# EasyEDA Pro project ProDoc_XC7K35T_GTP_USB_Core_LiteRevB.1.brd_2025-10-08.epro, schematic _CBB_INTERFACE_Type-C_24P_USB3.0_HD3SS3220
Board Name: _CBB_INTERFACE_Type-C_24P_USB3.0_HD3SS3220; Create Date: 2025-08-26; Page Name: P1; Project Name: XC7A35TCSG325_USB3_Demo; Schematic Name: _CBB_INTERFACE_Type-C_24P_USB3.0_HD3SS3220; Update Date: 2025-09-28; Company: Xxx Studio; Drawed: A.W.2666; Page Size: A3; Reviewed: A.W.2666; Version: Rev.A.0
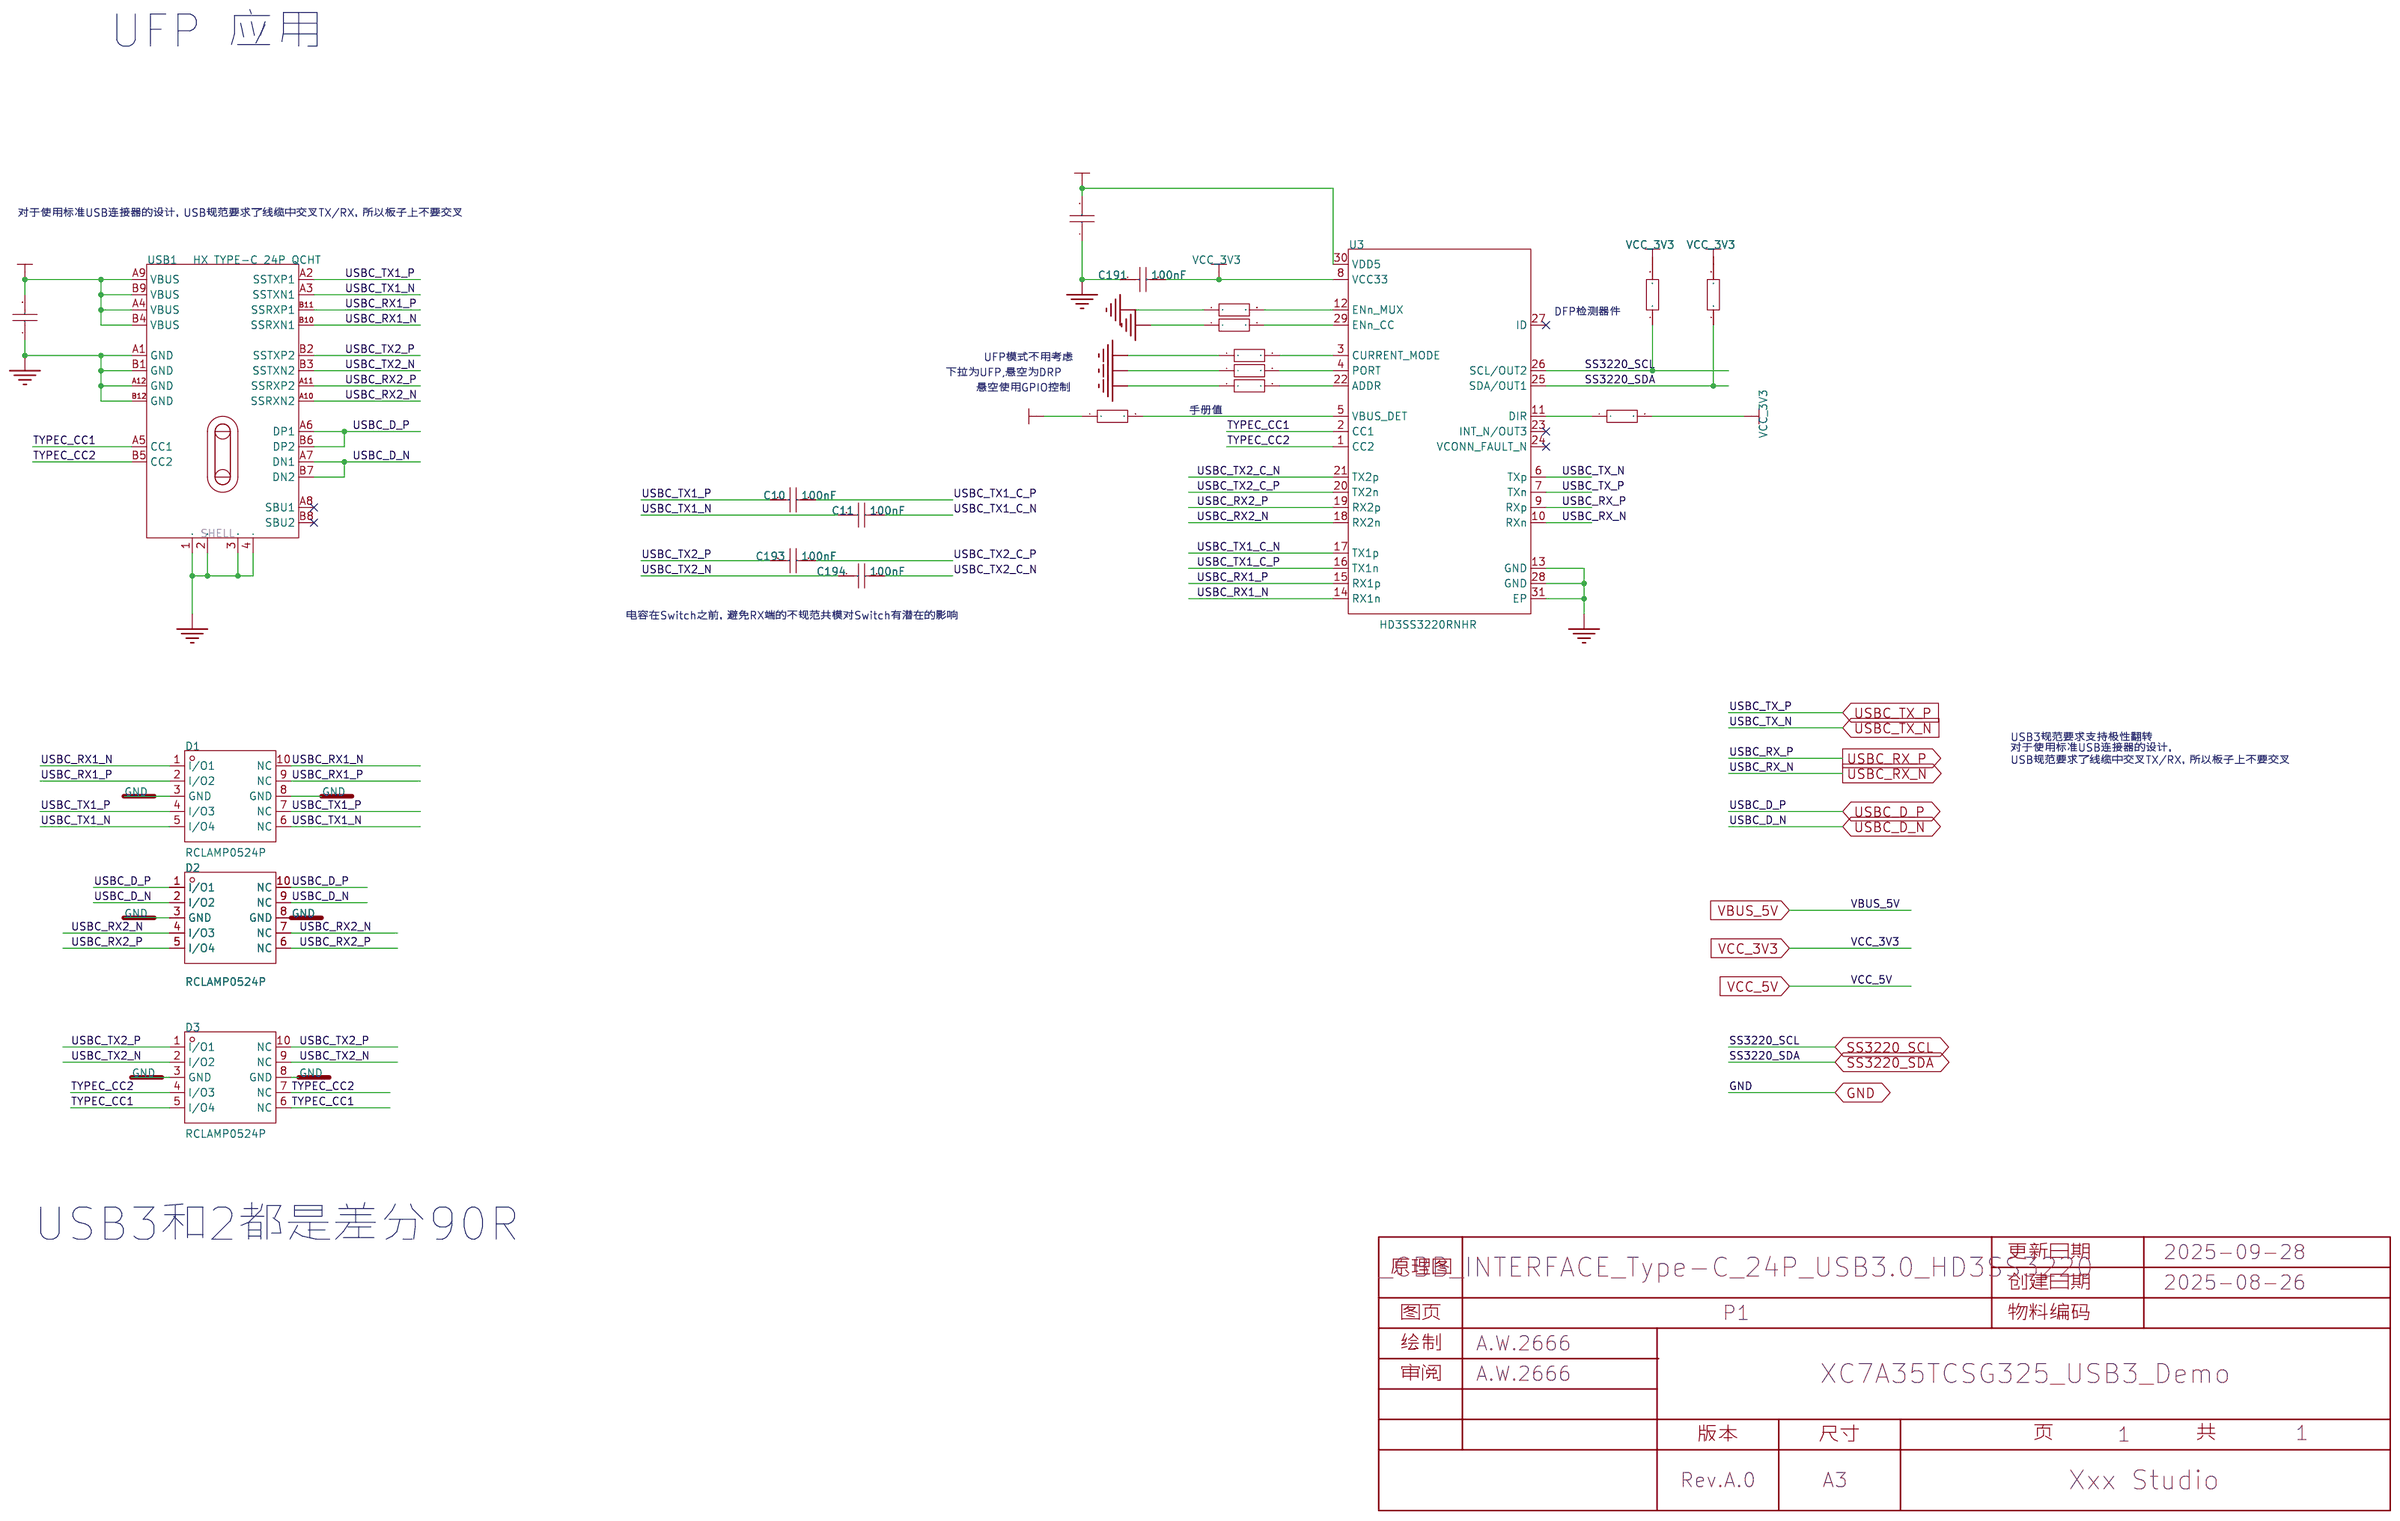
[diagram p12: schematic sheet]

## Parts
C1  4.7uF  [C0603_1608M]
C10  100nF  [C0402_1005M_S]
C11  100nF  [C0402_1005M_S]
C191  100nF  [C0402_1005M_S]
C192  4.7uF  [C0603_1608M_S]
C193  100nF  [C0402_1005M_S]
C194  100nF  [C0402_1005M_S]
D1  RCLAMP0524P  [DFN2510-10_L2.5-W1.0-P0.50-BL]
D2  RCLAMP0524P  [DFN2510-10_L2.5-W1.0-P0.50-BL]
D3  RCLAMP0524P  [DFN2510-10_L2.5-W1.0-P0.50-BL]
R2  910kΩ  [R0402_1005M_S]
R123  10kΩ  [R0402_1005M_S]  (no BOM)
R124  4.7kΩ  [R0402_1005M_S]
R125  200kΩ  [R0402_1005M_S]
R126  10kΩ  [R0402_1005M_S]
R127  10kΩ  [R0402_1005M_S]  (no BOM)
R128  10kΩ  [R0402_1005M_S]
R129  200kΩ  [R0402_1005M_S]
R130  200kΩ  [R0402_1005M_S]
U3  HD3SS3220RNHR  [WQFN-30_L4.5-W2.5-P0.4-BL-EP]
USB1  HX TYPE-C 24P QCHT  [TYPE-C-SMD_TYPE-C-24P_QCHT]

## Library data of the parts
C1 C192 = GRM188Z71A475KE15D: 容值:4.7uF;精度:±10%;额定电压:10V;材质(温度系数):X7R;; LCSC Part Name: 4.7uF ±10% 10V; Supplier Part: C913474; Manufacturer: muRata(村田); Supplier Footprint: 0603; JLCPCB Part Class: Extended Part; Datasheet: https://atta.szlcsc.com/upload/public/pdf/source/20201110/C913474_4DF5AD40636EBA2467CAA7A6A4C37EEF.pdf; Supplier: LCSC; Tolerance: ±10%; Voltage Rated: 10V; Temperature Coefficient: X7R
C10 C11 C191 C193 C194 = C0402: 容值:100nF;精度:±10%;额定电压:16V;材质(温度系数):X7R;; LCSC Part Name: 100nF ±10% 16V; Supplier Part: C60474; Manufacturer: YAGEO(国巨); Manufacturer Part: CC0402KRX7R7BB104; Supplier Footprint: 0402; Datasheet: https://atta.szlcsc.com/upload/public/pdf/source/20211223/9278FD768280B81DDBEF48FA36411A03.pdf; Supplier: LCSC; Tolerance: ±10%; Voltage Rated: 16V; Temperature Coefficient: X7R
D1-D3 = RCLAMP0524P_C907837: 极性:单向;反向截止电压(Vrwm):5V;最大钳位电压:17V;峰值脉冲电流(Ipp):4.5A;击穿电压:6.8V;; Supplier Part: C907837; Manufacturer: TECH PUBLIC(台舟); Supplier Footprint: DFN2510-10; JLCPCB Part Class: 扩展库; Datasheet: https://atta.szlcsc.com/upload/public/pdf/source/20210810/AE3DE9AC94AD2A317FD9BEA10653400F.pdf; Supplier: LCSC; polarity: 单向; Reverse Stand-Off Voltage (Vrwm): 5V; Maximum Clamping Voltage: 17V; Peak Pulse Current (Ipp): 4.5A; Breakdown Voltage: 6.8V; Reverse Leakage Current (Ir): 80nA; Number of Lines: 四路; Operating Temperature: -55℃~+125℃; level of protection: IEC 61000-4-2; Type: ESD
R2 = 0402WGF9103TCE: 电阻类型:厚膜电阻;阻值:910kΩ;精度:±1%;功率:62.5mW;工作电压:50V;温度系数:±100ppm/℃;; LCSC Part Name: 910kΩ ±1% 62.5mW 厚膜电阻; Supplier Part: C25800; Manufacturer: UNI-ROYAL(厚声); Supplier Footprint: 0402; JLCPCB Part Class: Extended Part; Datasheet: https://item.szlcsc.com/datasheet/0402WGF9103TCE/26543.html; Supplier: LCSC; Type: 厚膜电阻; Tolerance: ±1%; Power(Watts): 62.5mW; Voltage-Supply(Max): 50V; Temperature Coefficient: ±100ppm/℃; Operating Temperature: -55℃~+155℃
R123 R126-R128 = 0402WGF1002TCE: 电阻类型:厚膜电阻;阻值:10kΩ;精度:±1%;功率:62.5mW;最大工作电压:50V;温度系数:±100ppm/℃;; LCSC Part Name: 10kΩ ±1% 62.5mW 厚膜电阻; Supplier Part: C25744; Manufacturer: UNI-ROYAL(厚声); Supplier Footprint: 0402; JLCPCB Part Class: Basic Part; Datasheet: https://atta.szlcsc.com/upload/public/pdf/source/20200306/C422600_1E6D84923E4A46A82E41ADD87F860B5C.pdf; Supplier: LCSC; Type: 厚膜电阻; Tolerance: ±1%; Power(Watts): 62.5mW; Overload Voltage (Max): 50V; Temperature Coefficient: ±100ppm/℃; Operating Temperature Range: -55℃~+155℃
R124 = 0402WGF4701TCE: 电阻类型:厚膜电阻;阻值:4.7kΩ;精度:±1%;功率:62.5mW;最大工作电压:50V;温度系数:±100ppm/℃;; LCSC Part Name: 4.7kΩ ±1% 62.5mW 厚膜电阻; Supplier Part: C25900; Manufacturer: UNI-ROYAL(厚声); Supplier Footprint: 0402; JLCPCB Part Class: Basic Part; Datasheet: https://atta.szlcsc.com/upload/public/pdf/source/20200306/C422600_1E6D84923E4A46A82E41ADD87F860B5C.pdf; Supplier: LCSC; Type: 厚膜电阻; Tolerance: ±1%; Power(Watts): 62.5mW; Overload Voltage (Max): 50V; Temperature Coefficient: ±100ppm/℃; Operating Temperature Range: -55℃~+155℃
R125 R129 R130 = 0402WGF2003TCE: 电阻类型:厚膜电阻;阻值:200kΩ;精度:±1%;功率:62.5mW;最大工作电压:50V;温度系数:±100ppm/℃;; LCSC Part Name: 200kΩ ±1% 62.5mW 厚膜电阻; Supplier Part: C25764; Manufacturer: UNI-ROYAL(厚声); Supplier Footprint: 0402; JLCPCB Part Class: Basic Part; Datasheet: https://atta.szlcsc.com/upload/public/pdf/source/20200306/C422600_1E6D84923E4A46A82E41ADD87F860B5C.pdf; Supplier: LCSC; Type: 厚膜电阻; Tolerance: ±1%; Power(Watts): 62.5mW; Overload Voltage (Max): 50V; Temperature Coefficient: ±100ppm/℃; Operating Temperature Range: -55℃~+155℃
U3 = HD3SS3220RNHR: 带CC处理的USB Switch工作电压:4.5V~5.5V;; Supplier Part: C165155; Manufacturer: TI(德州仪器); Supplier Footprint: WQFN-30-EP(2.5x4.5); JLCPCB Part Class: Extended Part; Datasheet: https://www.ti.com/cn/lit/gpn/hd3ss3220; Supplier: LCSC; Voltage - Supply: 4.5V~5.5V; Operating Temperature: -40℃~+85℃
USB1 = TYPE-C_24P_HX_QCHT: 连接器类型:Type-C;标准:USB 3.1;公母:母;安装方式:卧贴;触点数量:16P;端口数量:1;额定电流 - 电源:5A;工作温度范围:-30℃~+80℃;; LCSC Part Name: Type-C 母 卧贴; Supplier Part: C5178545; Manufacturer: hanxia(韩下); Supplier Footprint: SMD; JLCPCB Part Class: Extended Part; Datasheet: https://atta.szlcsc.com/upload/public/pdf/source/20220920/59AC43AA2FE66A72371D54E17EF43F69.pdf; Supplier: LCSC; Connector Type: Type-C; Standard: USB 3.1; Gender: 母; Mounting Style: 卧贴; Number of Contacts: 16P; Number of Ports: 1; Current Rating - Power (Max): 5A; Rated Voltage (Max): 20V; Connect-Disconnect Life: 1万次; Length: 9.87mm; Core Colour: 黑色; Operating Temperature Range: -30℃~+80℃

## Nets
GND: C1.1 C191.1 C192.1 D1.3(GND) D1.8(GND) D2.3(GND) D2.8(GND) D3.3(GND) D3.8(GND) R123.1 R124.1 R126.1 R127.1 R128.1 U3.13(GND) U3.28(GND) U3.31(EP) USB1.1 USB1.2 USB1.3 USB1.4 USB1.A1(GND) USB1.A12(GND) USB1.B1(GND) USB1.B12(GND)
VBUS_5V: C1.2 R2.1 USB1.A4(VBUS) USB1.A9(VBUS) USB1.B4(VBUS) USB1.B9(VBUS)
VCC_3V3: C191.2 R125.2 R129.2 R130.2 U3.8(VCC33)
VCC_5V: C192.2 U3.30(VDD5)
SS3220_SCL: R129.1 U3.26(SCL/OUT2)
SS3220_SDA: R130.1 U3.25(SDA/OUT1)
TYPEC_CC1: D3.5(I/O4) D3.6(NC) U3.2(CC1) USB1.A5(CC1)
TYPEC_CC2: D3.4(I/O3) D3.7(NC) U3.1(CC2) USB1.B5(CC2)
USBC_D_N: D2.2(I/O2) D2.9(NC) USB1.A7(DN1) USB1.B7(DN2)
USBC_D_P: D2.1(I/O1) D2.10(NC) USB1.A6(DP1) USB1.B6(DP2)
USBC_RX1_N: D1.1(I/O1) D1.10(NC) U3.14(RX1n) USB1.B10(SSRXN1)
USBC_RX1_P: D1.2(I/O2) D1.9(NC) U3.15(RX1p) USB1.B11(SSRXP1)
USBC_RX2_N: D2.4(I/O3) D2.7(NC) U3.18(RX2n) USB1.A10(SSRXN2)
USBC_RX2_P: D2.5(I/O4) D2.6(NC) U3.19(RX2p) USB1.A11(SSRXP2)
USBC_RX_N: U3.10(RXn)
USBC_RX_P: U3.9(RXp)
USBC_TX1_C_N: C11.2 U3.17(TX1p)
USBC_TX1_C_P: C10.2 U3.16(TX1n)
USBC_TX1_N: C11.1 D1.5(I/O4) D1.6(NC) USB1.A3(SSTXN1)
USBC_TX1_P: C10.1 D1.4(I/O3) D1.7(NC) USB1.A2(SSTXP1)
USBC_TX2_C_N: C194.2 U3.21(TX2p)
USBC_TX2_C_P: C193.2 U3.20(TX2n)
USBC_TX2_N: C194.1 D3.2(I/O2) D3.9(NC) USB1.B3(SSTXN2)
USBC_TX2_P: C193.1 D3.1(I/O1) D3.10(NC) USB1.B2(SSTXP2)
USBC_TX_N: U3.6(TXp)
USBC_TX_P: U3.7(TXn)
$1N3017: R2.2 U3.5(VBUS_DET)
$1N3099: R123.2 U3.3(CURRENT_MODE)
$1N3103: R124.2 U3.4(PORT)
$1N3105: R125.1 U3.11(DIR)
$1N3107: R126.2 U3.12(ENn_MUX)
$1N3109: R127.2 U3.22(ADDR)
$1N3115: R128.2 U3.29(ENn_CC)

Not connected (* = marked no-connect by the designer): U3 23(INT_N/OUT3)* 24(VCONN_FAULT_N)* 27(ID)*; USB1 A8(SBU1)* B8(SBU2)*

## Notes on the sheet
- UFP 应用
- 对于使用标准USB连接器的设计，USB规范要求了线缆中交叉TX/RX，所以板子上不要交叉
- DFP检测器件
- UFP模式不用考虑
- 下拉为UFP,悬空为DRP
- 悬空使用GPIO控制
- 手册值
- 电容在Switch之前，避免RX端的不规范共模对Switch有潜在的影响
- USB3规范要求支持极性翻转
- 对于使用标准USB连接器的设计，
  USB规范要求了线缆中交叉TX/RX，所以板子上不要交叉
- USB3和2都是差分90R
